# Altium schematic sheet 2_IOConvert.SchDoc
size A4
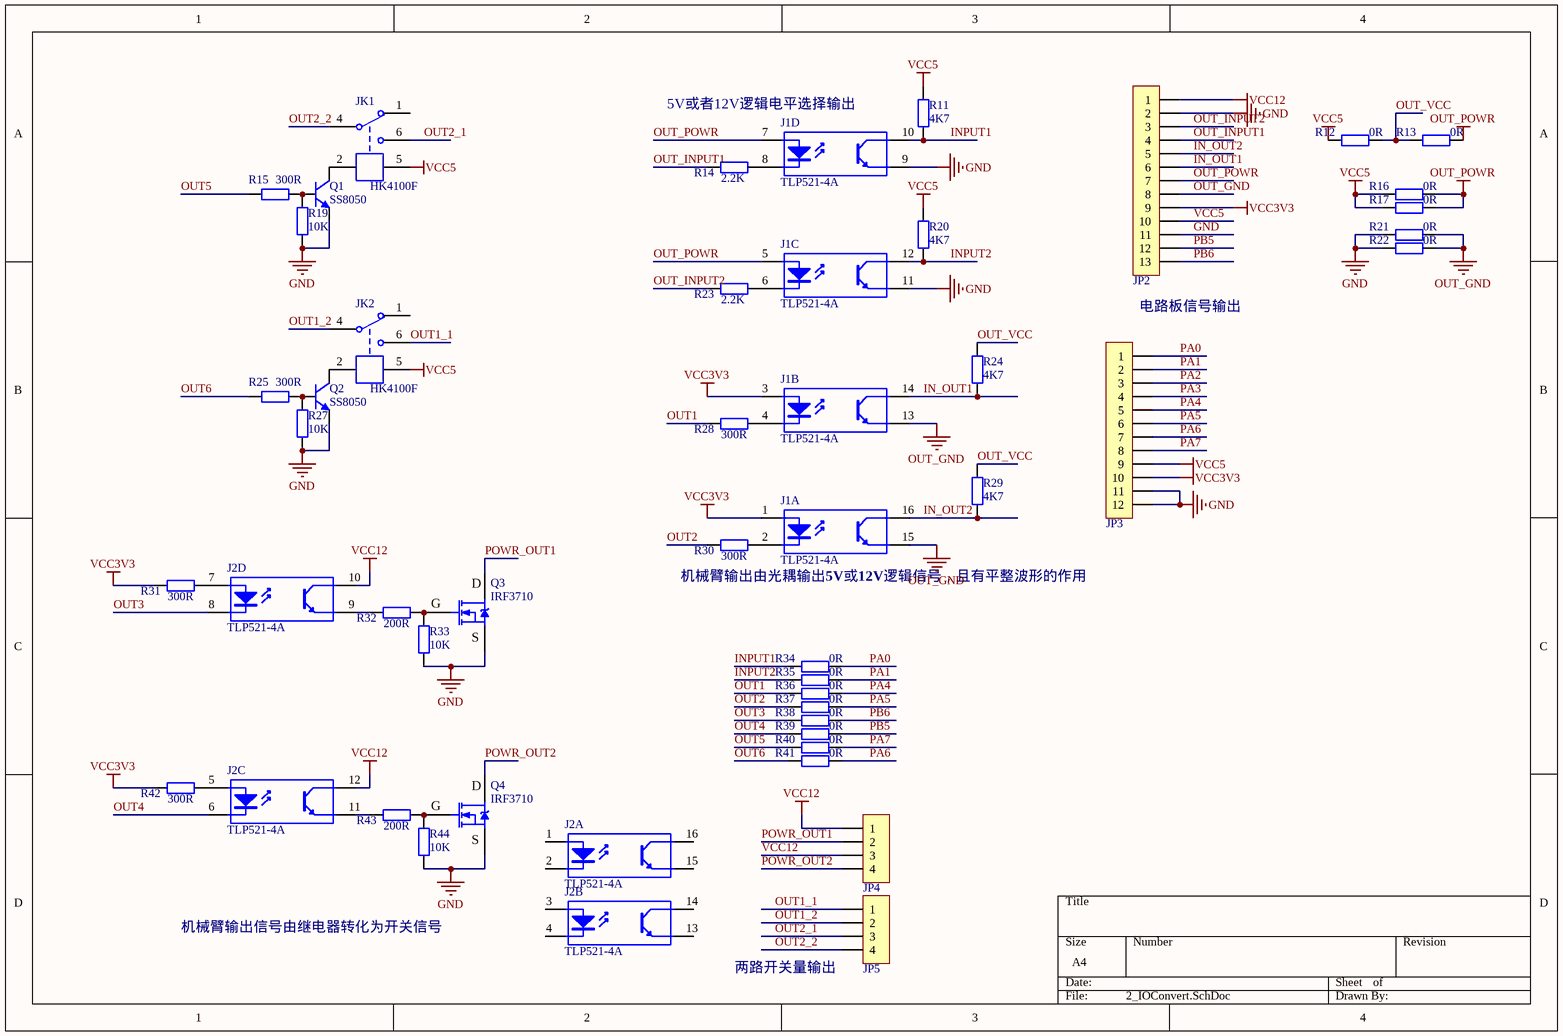
[diagram p0: 2_IOConvert.SchDoc]

## Parts
J1  TLP521-4A  [SOP16_M]  (parts A,B,C,D of 4)
J2  TLP521-4A  [SOP16_M]  (parts A,B,C,D of 4)
JK1  HK4100F  [HK4100F]
JK2  HK4100F  [HK4100F]
JP2  HDR-1X13  [KF128-3.81-13P]  (value not drawn)
JP3  HDR-1X12  [KF128-3.81-12P]  (value not drawn)
JP4  HDR-1X4  [KF128-3.81-4P]  (value not drawn)
JP5  HDR-1X4  [KF128-3.81-4P]  (value not drawn)
Q1  SS8050  [SOT23-3L]
Q2  SS8050  [SOT23-3L]
Q3  IRF3710  [TO252]
Q4  IRF3710  [TO252]
R11  4K7  [LC-0603_R]
R12  0R  [LC-0603_R]
R13  0R  [LC-0603_R]
R14  2.2K  [LC-0603_R]
R15  300R  [LC-0603_R]
R16  0R  [LC-0603_R]
R17  0R  [LC-0603_R]
R19  10K  [LC-0603_R]
R20  4K7  [LC-0603_R]
R21  0R  [LC-0603_R]
R22  0R  [LC-0603_R]
R23  2.2K  [LC-0603_R]
R24  4K7  [LC-0603_R]
R25  300R  [LC-0603_R]
R27  10K  [LC-0603_R]
R28  300R  [LC-0603_R]
R29  4K7  [LC-0603_R]
R30  300R  [LC-0603_R]
R31  300R  [LC-0603_R]
R32  200R  [LC-0603_R]
R33  10K  [LC-0603_R]
R34  0R  [LC-0603_R]
R35  0R  [LC-0603_R]
R36  0R  [LC-0603_R]
R37  0R  [LC-0603_R]
R38  0R  [LC-0603_R]
R39  0R  [LC-0603_R]
R40  0R  [LC-0603_R]
R41  0R  [LC-0603_R]
R42  300R  [LC-0603_R]
R43  200R  [LC-0603_R]
R44  10K  [LC-0603_R]

## Nets
GND: J1.9(4E) J1.11(3E) JP2.2 JP2.11 JP3.11 JP3.12 Q1.2(E) Q2.2(E) Q3.3(S) Q4.3(S) R19.1 R21.2 R22.2 R27.1 R33.1 R44.1
OUT_GND: J1.13(2E) J1.15(1E) JP2.8 R21.1 R22.1
OUT_POWR: J1.5(3A) J1.7(4A) JP2.7 R13.1 R16.1 R17.1
VCC3V3: J1.1(1A) J1.3(2A) JP2.9 JP3.10 R31.2 R42.2
VCC5: JK1.5 JK2.5 JP2.10 JP3.9 R11.2 R12.2 R16.2 R17.2 R20.2
VCC12: J2.10(4C) J2.12(3C) JP2.1 JP4.1 JP4.3
IN_OUT1: J1.14(2C) JP2.6 R24.1
IN_OUT2: J1.16(1C) JP2.5 R29.1
INPUT1: J1.10(4C) R11.1 R34.2
INPUT2: J1.12(3C) R20.1 R35.2
OUT1: R28.2 R36.2
OUT1_1: JK2.6 JP5.1
OUT1_2: JK2.4 JP5.2
OUT2: R30.2 R37.2
OUT2_1: JK1.6 JP5.3
OUT2_2: JK1.4 JP5.4
OUT3: J2.8(4K) R38.2
OUT4: J2.6(3K) R39.2
OUT5: R15.1 R40.2
OUT6: R25.1 R41.2
OUT_INPUT1: JP2.4 R14.2
OUT_INPUT2: JP2.3 R23.2
OUT_VCC: R12.1 R13.2 R24.2 R29.2
PA0: JP3.1 R34.1
PA1: JP3.2 R35.1
PA2: JP3.3
PA3: JP3.4
PA4: JP3.5 R36.1
PA5: JP3.6 R37.1
PA6: JP3.7 R41.1
PA7: JP3.8 R40.1
PB5: JP2.12 R39.1
PB6: JP2.13 R38.1
POWR_OUT1: JP4.2 Q3.2(D)
POWR_OUT2: JP4.4 Q4.2(D)
NetJ1_2: J1.2(1K) R30.1
NetJ1_4: J1.4(2K) R28.1
NetJ1_6: J1.6(3K) R23.1
NetJ1_8: J1.8(4K) R14.1
NetJ2_5: J2.5(3A) R42.1
NetJ2_7: J2.7(4A) R31.1
NetJ2_9: J2.9(4E) R32.2
NetJ2_11: J2.11(3E) R43.2
NetJK1_2: JK1.2 Q1.3(C)
NetJK2_2: JK2.2 Q2.3(C)
NetQ1_1: Q1.1(B) R15.2 R19.2
NetQ2_1: Q2.1(B) R25.2 R27.2
NetQ3_1: Q3.1(G) R32.1 R33.2
NetQ4_1: Q4.1(G) R43.1 R44.2

Not connected (* = marked no-connect by the designer): J2 1(1A) 2(1K) 3(2A) 4(2K) 13(2E) 14(2C) 15(1E) 16(1C); JK1 1; JK2 1

## Notes on the sheet
- (near J1) 5V或者12V逻辑电平选择输出
- 电路板信号输出
- 机械臂输出由光耦输出5V或12V逻辑信号，且有平整波形的作用
- 机械臂输出信号由继电器转化为开关信号
- 两路开关量输出

## Library data of the parts
J1 J2 = TLP521-4A: 4路开关光耦; 版权归属: 源创客; BOM名称: 4路开关光耦; 学习资源: www.ooocke.com
JK1 JK2 = HK4100F: 一组转换; BOM名称: 一组继电器; 版权归属: 源创客; 学习资源: www.ooocke.com
JP2 = Header 13: 13P接插件; 版权归属: 源创客; BOM名称: 13P接插件; 学习资源: www.ooocke.com
JP3 = Header 12: 12P接插件; 版权归属: 源创客; BOM名称: 12P接插件; 学习资源: www.ooocke.com
JP4 JP5 = Header 4: 4P接插件; 版权归属: 源创客; BOM名称: 4P接插件; 学习资源: www.ooocke.com
Q1 Q2 = 8050-SMD: 高频放大-NPN型; 版权归属: 源创客; 属性: 40V 1.5A 1W 100MHZ; BOM名称: 高频放大-NPN型; 学习资源: www.ooocke.com
Q3 Q4 = IRF3710: N沟场效应管; 版权归属: 源创客; BOM名称: N沟场效应管; 学习资源: www.ooocke.com
R11-R17 R19-R25 R27-R44 = 0603 680KΩ (6803) 1%: 贴片电阻; ComponentLink1Description: 供应商链接; ComponentLink1URL: http://www.szlcsc.com/product/details_26565.html; Package: 0603; Supplier: LC; SuppliersPartNumber: C25822